# EAGLE design expansion_module_sw8_btn4 (EAGLE 9.6.2)
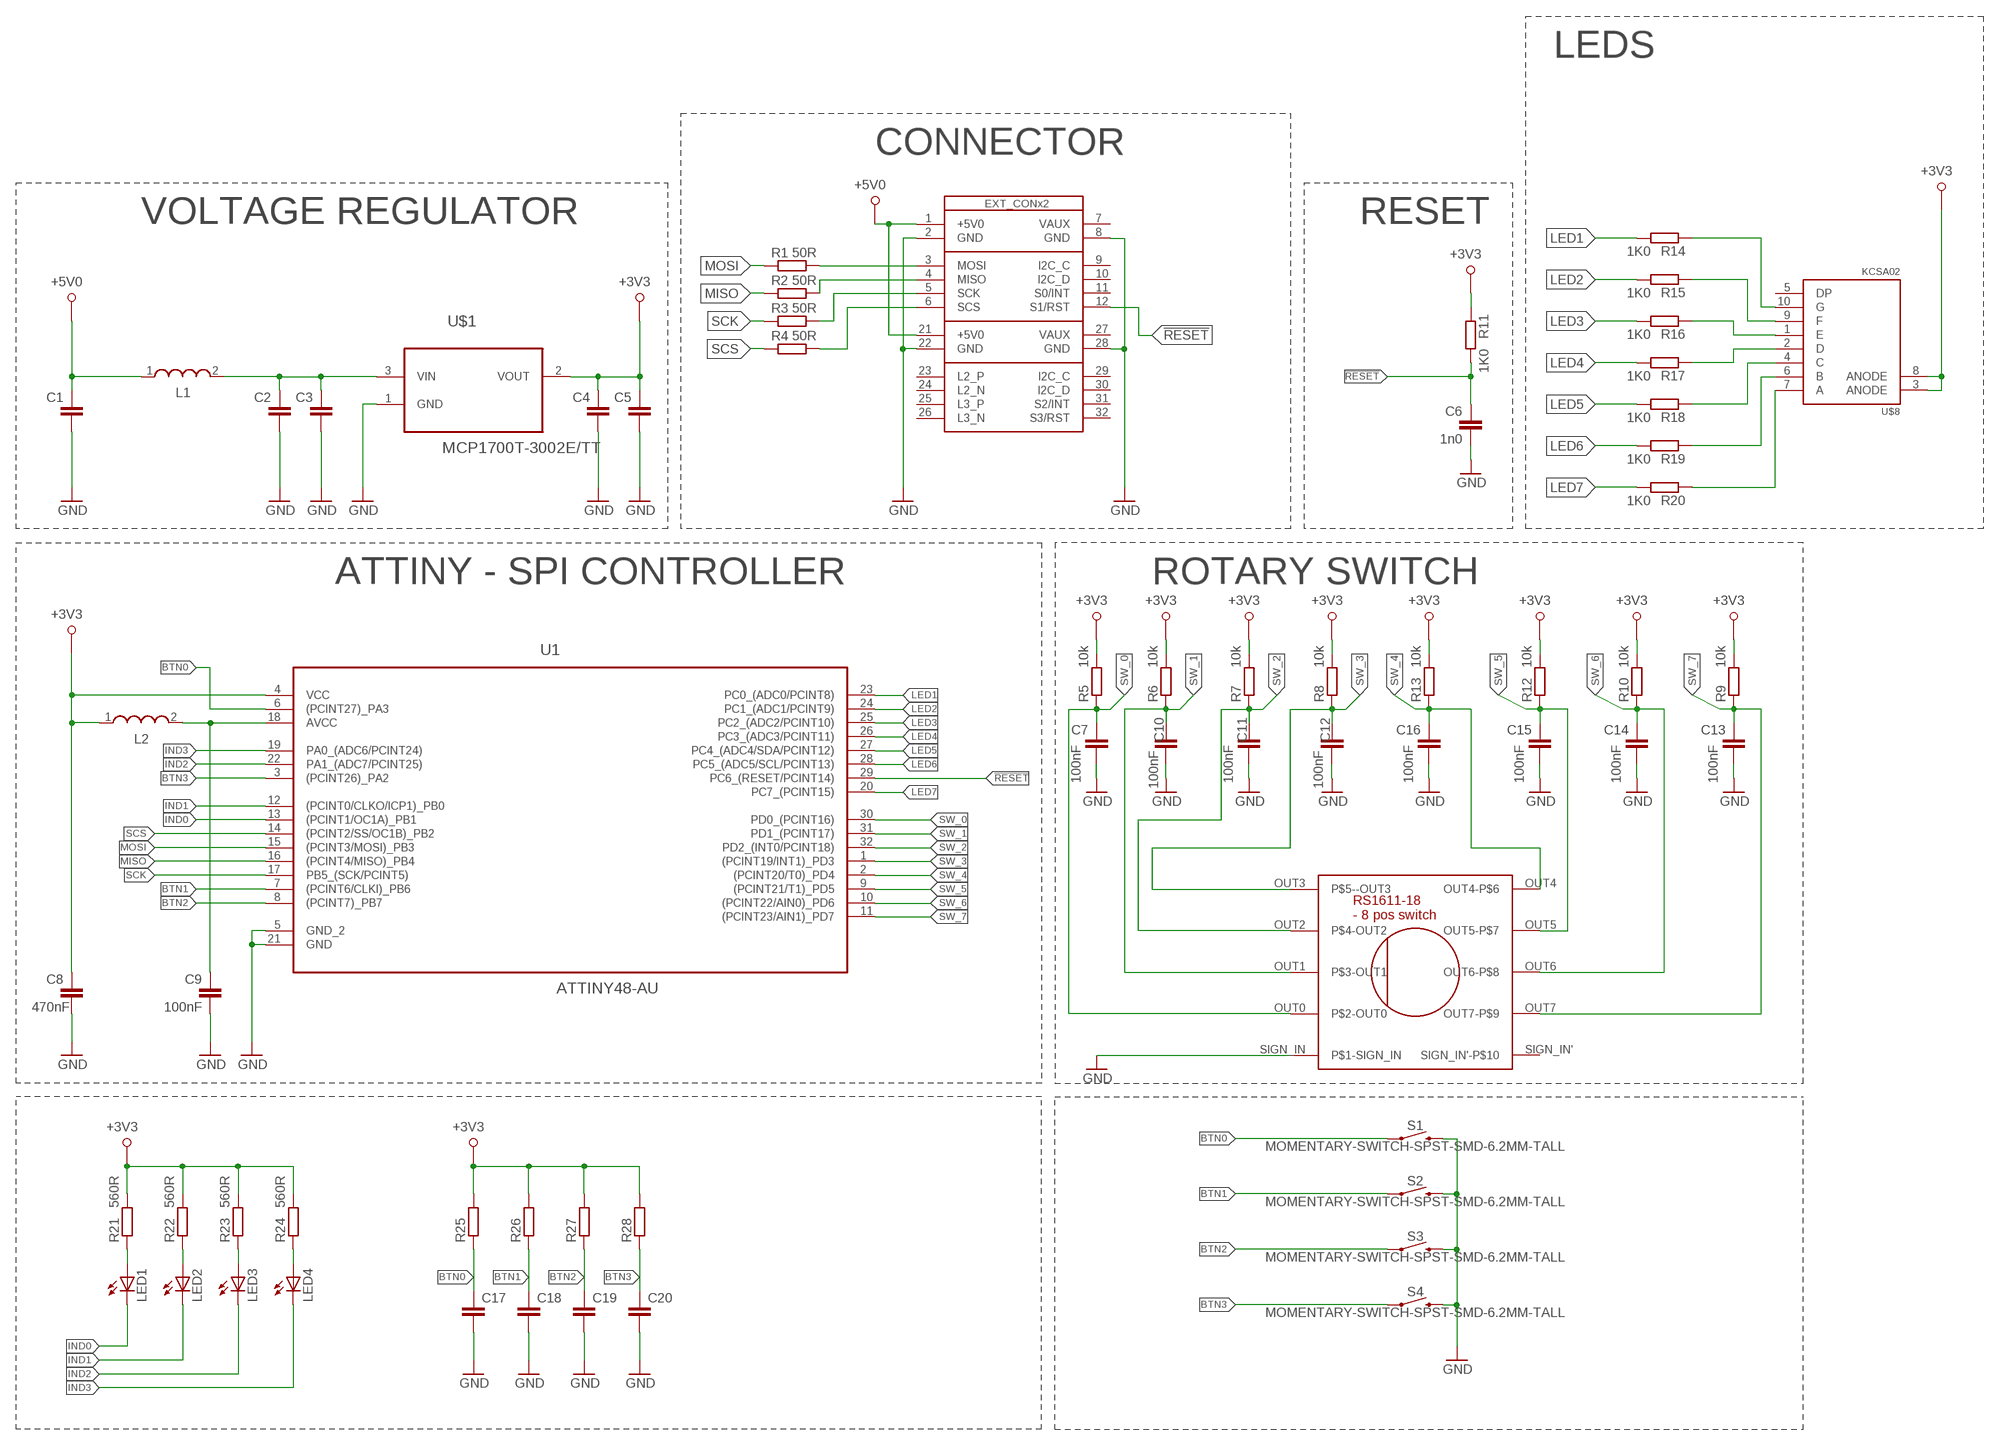
[diagram p0: schematic, sheet 1]

## Parts
C1  C-EUC0805  [C0805]
C2  C-EUC0805  [C0805]
C3  C-EUC0805  [C0805]
C4  C-EUC0805  [C0805]
C5  C-EUC0805  [C0805]
C6  1n0  C-EUC0805  [C0805]
C7  100nF  C-EUC0805  [C0805]
C8  470nF  C-EUC0805  [C0805]
C9  100nF  C-EUC0805  [C0805]
C10  100nF  C-EUC0805  [C0805]
C11  100nF  C-EUC0805  [C0805]
C12  100nF  C-EUC0805  [C0805]
C13  100nF  C-EUC0805  [C0805]
C14  100nF  C-EUC0805  [C0805]
C15  100nF  C-EUC0805  [C0805]
C16  100nF  C-EUC0805  [C0805]
C17  C-EUC0603K  [C0603K]
C18  C-EUC0603K  [C0603K]
C19  C-EUC0603K  [C0603K]
C20  C-EUC0603K  [C0603K]
L1  WE-LQ_1210  [WE-LQ_M]
L2  WE-PMI_0805  [WE-PMI_0805]
LED1  LEDCHIPLED_0805  [CHIPLED_0805]
LED2  LEDCHIPLED_0805  [CHIPLED_0805]
LED3  LEDCHIPLED_0805  [CHIPLED_0805]
LED4  LEDCHIPLED_0805  [CHIPLED_0805]
R1  50R  R-EU_R0805  [R0805]
R2  50R  R-EU_R0805  [R0805]
R3  50R  R-EU_R0805  [R0805]
R4  50R  R-EU_R0805  [R0805]
R5  10k  R-EU_R0805  [R0805]
R6  10k  R-EU_R0805  [R0805]
R7  10k  R-EU_R0805  [R0805]
R8  10k  R-EU_R0805  [R0805]
R9  10k  R-EU_R0805  [R0805]
R10  10k  R-EU_R0805  [R0805]
R11  1K0  R-EU_R0805  [R0805]
R12  10k  R-EU_R0805  [R0805]
R13  10k  R-EU_R0805  [R0805]
R14  1K0  R-EU_R0805  [R0805]
R15  1K0  R-EU_R0805  [R0805]
R16  1K0  R-EU_R0805  [R0805]
R17  1K0  R-EU_R0805  [R0805]
R18  1K0  R-EU_R0805  [R0805]
R19  1K0  R-EU_R0805  [R0805]
R20  1K0  R-EU_R0805  [R0805]
R21  560R  R-EU_R0805  [R0805]
R22  560R  R-EU_R0805  [R0805]
R23  560R  R-EU_R0805  [R0805]
R24  560R  R-EU_R0805  [R0805]
R25  R-EU_R0603  [R0603]
R26  R-EU_R0603  [R0603]
R27  R-EU_R0603  [R0603]
R28  R-EU_R0603  [R0603]
S1  MOMENTARY-SWITCH-SPST-SMD-6.2MM-TALL  [TACTILE_SWITCH_SMD_6.2MM_TALL]
S2  MOMENTARY-SWITCH-SPST-SMD-6.2MM-TALL  [TACTILE_SWITCH_SMD_6.2MM_TALL]
S3  MOMENTARY-SWITCH-SPST-SMD-6.2MM-TALL  [TACTILE_SWITCH_SMD_6.2MM_TALL]
S4  MOMENTARY-SWITCH-SPST-SMD-6.2MM-TALL  [TACTILE_SWITCH_SMD_6.2MM_TALL]
U1  ATTINY48-AU  [QFP80P900X900X120-32N]
U$1  MCP1700T-3002E/TT  [SOT95P237X112-3N]
U$8  KCSA02-109-SMALL  [KCSX02-SM]
U$20  RS1611-18_ROTARY_SW  [RS1611-PACKAGE]
U$37  SB_EXT_CON_X2_SPI  [SB_EXT_CON_X2_FULL]

## Nets
!RESET: C6.2 R11.2 U1.29(PC6_(RESET/PCINT14)) U$37.12(S1/RST)
+3V3: C4.2 C5.2 C8.2 L2.1 R5.2 R6.2 R7.2 R8.2 R9.2 R10.2 R11.1 R12.2 R13.2 R21.2 R22.2 R23.2 R24.2 R25.2 R26.2 R27.2 R28.2 U1.4(VCC) U$1.2(VOUT) U$8.3(ANODE) U$8.8(ANODE)
+5V0: C1.2 L1.1 U$37.1(+5V0) U$37.21(+5V0)
BTN0: C17.1 R25.1 S1.A2 U1.6((PCINT27)_PA3)
BTN1: C18.1 R26.1 S2.A2 U1.7((PCINT6/CLKI)_PB6)
BTN2: C19.1 R27.1 S3.A2 U1.8((PCINT7)_PB7)
BTN3: C20.1 R28.1 S4.A2 U1.3((PCINT26)_PA2)
GND: C1.1 C2.1 C3.1 C4.1 C5.1 C6.1 C7.1 C8.1 C9.1 C10.1 C11.1 C12.1 C13.1 C14.1 C15.1 C16.1 C17.2 C18.2 C19.2 C20.2 S1.B2 S2.B2 S3.B2 S4.B2 U1.5(GND_2) U1.21(GND) U$1.1(GND) U$20.SIGN_IN(P$1-SIGN_IN) U$37.2(GND) U$37.8(GND) U$37.22(GND) U$37.28(GND)
IND0: LED1.C U1.13((PCINT1/OC1A)_PB1)
IND1: LED2.C U1.12((PCINT0/CLKO/ICP1)_PB0)
IND2: LED3.C U1.22(PA1_(ADC7/PCINT25))
IND3: LED4.C U1.19(PA0_(ADC6/PCINT24))
LED1: R14.2 U1.23(PC0_(ADC0/PCINT8))
LED2: R15.2 U1.24(PC1_(ADC1/PCINT9))
LED3: R16.2 U1.25(PC2_(ADC2/PCINT10))
LED4: R17.2 U1.26(PC3_(ADC3/PCINT11))
LED5: R18.2 U1.27(PC4_(ADC4/SDA/PCINT12))
LED6: R19.2 U1.28(PC5_(ADC5/SCL/PCINT13))
LED7: R20.2 U1.20(PC7_(PCINT15))
MISO: R2.1 U1.16((PCINT4/MISO)_PB4)
MOSI: R1.1 U1.15((PCINT3/MOSI)_PB3)
N$1: R1.2 U$37.3(MOSI)
N$2: R2.2 U$37.4(MISO)
N$3: R3.2 U$37.5(SCK)
N$4: R4.2 U$37.6(SCS)
N$6: C9.2 L2.2 U1.18(AVCC)
N$7: LED1.A R21.1
N$8: C2.2 C3.2 L1.2 U$1.3(VIN)
N$9: R14.1 U$8.10(G)
N$11: R15.1 U$8.9(F)
N$12: R16.1 U$8.1(E)
N$13: R17.1 U$8.2(D)
N$14: R18.1 U$8.4(C)
N$15: R19.1 U$8.6(B)
N$16: R20.1 U$8.7(A)
N$17: LED2.A R22.1
N$18: LED3.A R23.1
N$19: LED4.A R24.1
SCK: R3.1 U1.17(PB5_(SCK/PCINT5))
SCS: R4.1 U1.14((PCINT2/SS/OC1B)_PB2)
SW_0: C7.2 R5.1 U1.30(PD0_(PCINT16)) U$20.OUT0(P$2-OUT0)
SW_1: C10.2 R6.1 U1.31(PD1_(PCINT17)) U$20.OUT1(P$3-OUT1)
SW_2: C11.2 R7.1 U1.32(PD2_(INT0/PCINT18)) U$20.OUT2(P$4-OUT2)
SW_3: C12.2 R8.1 U1.1((PCINT19/INT1)_PD3) U$20.OUT3(P$5--OUT3)
SW_4: C16.2 R13.1 U1.2((PCINT20/T0)_PD4) U$20.OUT4(OUT4-P$6)
SW_5: C15.2 R12.1 U1.9((PCINT21/T1)_PD5) U$20.OUT5(OUT5-P$7)
SW_6: C14.2 R10.1 U1.10((PCINT22/AIN0)_PD6) U$20.OUT6(OUT6-P$8)
SW_7: C13.2 R9.1 U1.11((PCINT23/AIN1)_PD7) U$20.OUT7(OUT7-P$9)
Unconnected: U$8.5(DP) U$20.SIGN_IN'(SIGN_IN'-P$10) U$37.7(VAUX) U$37.9(I2C_C) U$37.10(I2C_D) U$37.11(S0/INT) U$37.23(L2_P) U$37.24(L2_N) U$37.25(L3_P) U$37.26(L3_N) U$37.27(VAUX) U$37.29(I2C_C) U$37.30(I2C_D) U$37.31(S2/INT) U$37.32(S3/RST)

## Notes on the sheet
- LEDS
- CONNECTOR
- VOLTAGE REGULATOR | RESET
- ATTINY - SPI CONTROLLER | ROTARY SWITCH

## Library data of the parts
C1-C20 = resistor:C-EU: CAPACITOR, European symbol
L1 = EagleLibrary_Wuerth_Elektronik_eiSos_rev16a:WE-LQ: SMD Inductor Characteristics Miniature chip inductor wound on a special ferrite core Small inductances for compact circuits High Q at high frequencies Low DC-resistance Operating temperature: –40 ºC to +125 ºC Applications Low power DC/DC-converters from Linear Technology, National Semiconductor, Texas Instruments, Fairchild Semiconductor, ON Semiconductor, STMicroelectronics, Maxim, MPS, Semtech, Exar, Analogic Tech, Diodes and Cologne Chip EMI-Filtering RF-circuits <http://katalog.we-online.de/media/images/eisos/IndLQ_pf2.jpg> Details see: http://katalog.we-online.de/en/pbs/WE-LQ? Updated by Dan Xu 2014-07-08 2014 (C) Wurth Elektronik
L2 = EagleLibrary_Wuerth_Elektronik_eiSos_rev16a:WE-PMI: Power Multilayer Inductor Characteristics Compact multilayer type Suitable for applications with high currents up to 2.7 A Smallest RDC-Values starting at 40 mΩ Magnetically shielded construction: No crosstalk Operating temperature: –40 °C to +125 °C Available in four sizes and three different types (Low Profile, Low RDC & High Saturation Current) Recommended soldering profile: Reflow Applications DC/DC converters especially at high switching frequencies > 1 MHz Electronic devices with very low profile Portable devices like Smart Phones, Tablets, Notebooks and Digital Cameras <http://katalog.we-online.de/media/images/eisos/IndPMI_pf2.jpgg> Details see: http://katalog.we-online.de/en/pbs/WE-PMI? Updated by Dan Xu 2014-07-08 2014 (C) Wurth Elektronik
LED1-LED4 = led:LED: LED OSRAM: - CHIPLED LG R971, LG N971, LY N971, LG Q971, LY Q971, LO R971, LY R971 LH N974, LH R974 LS Q976, LO Q976, LY Q976 LO Q996 - Hyper CHIPLED LW Q18S LB Q993, LB Q99A, LB R99A - SideLED LS A670, LO A670, LY A670, LG A670, LP A670 LB A673, LV A673, LT A673, LW A673 LH A674 LY A675 LS A676, LA A676, LO A676, LY A676, LW A676 LS A679, LY A679, LG A679 - Hyper Micro SIDELED® LS Y876, LA Y876, LO Y876, LY Y876 LT Y87S - SmartLED LW L88C, LW L88S LB L89C, LB L89S, LG L890 LS L89K, LO L89K, LY L89K LS L896, LA L896, LO L896, LY L896 - TOPLED LS T670, LO T670, LY T670, LG T670, LP T670 LSG T670, LSP T670, LSY T670, LOP T670, LYG T670 LG T671, LOG T671, LSG T671 LB T673, LV T673, LT T673, LW T673 LH T674 LS T676, LA T676, LO T676, LY T676, LB T676, LH T676, LSB T676, LW T676 LB T67C, LV T67C, LT T67C, LS T67K, LO T67K, LY T67K, LW E67C LS E67B, LA E67B, LO E67B, LY E67B, LB E67C, LV E67C, LT E67C LW T67C LS T679, LY T679, LG T679 LS T770, LO T770, LY T770, LG T770, LP T770 LB T773, LV T773, LT T773, LW T773 LH T774 LS E675, LA E675, LY E675, LS T675 LS T776, LA T776, LO T776, LY T776, LB T776 LHGB T686 LT T68C, LB T68C - Hyper Mini TOPLED® LB M676 - Mini TOPLED Santana® LG M470 LS M47K, LO M47K, LY M47K Source: http://www.osram.convergy.de LUXEON: - LUMILED® LXK2-PW12-R00, LXK2-PW12-S00, LXK2-PW14-U00, LXK2-PW14-V00 LXK2-PM12-R00, LXK2-PM12-S00, LXK2-PM14-U00 LXK2-PE12-Q00, LXK2-PE12-R00, LXK2-PE12-S00, LXK2-PE14-T00, LXK2-PE14-U00 LXK2-PB12-K00, LXK2-PB12-L00, LXK2-PB12-M00, LXK2-PB14-N00, LXK2-PB14-P00, LXK2-PB14-Q00 LXK2-PR12-L00, LXK2-PR12-M00, LXK2-PR14-Q00, LXK2-PR14-R00 LXK2-PD12-Q00, LXK2-PD12-R00, LXK2-PD12-S00 LXK2-PH12-R00, LXK2-PH12-S00 LXK2-PL12-P00, LXK2-PL12-Q00, LXK2-PL12-R00 Source: www.luxeon.com KINGBRIGHT: KA-3528ASYC Source: www.kingbright.com
R1-R28 = resistor:R-EU_: RESISTOR, European symbol
S1-S4 = SparkFun-Switches:MOMENTARY-SWITCH-SPST: Momentary Switch (Pushbutton) - SPST Normally-open (NO) SPST momentary switches (buttons, pushbuttons). Variants PTH-12MM - 12mm square, through-hole Momentary Pushbutton Switch - 12mm Square <https://www.sparkfun.com/products/9190> (COM-09190) PTH-6.0MM, PTH-6.0MM-KIT - 6.0mm square, through-hole Mini Pushbutton Switch <https://www.sparkfun.com/products/97> (COM-00097) KIT package intended for soldering kit's - only one side of pads' copper is exposed. PTH-RIGHT-ANGLE-KIT - Right-angle, through-hole Right Angle Tactile Button <https://www.sparkfun.com/products/10791> - Used on SparkFun BigTime Watch Kit <https://www.sparkfun.com/products/11734> SMD-12MM - 12mm square, surface-mount Tactile Button - SMD (12mm) <https://www.sparkfun.com/products/12993> (COM-12993) Used on SparkFun PicoBoard <https://www.sparkfun.com/products/11888> SMD-4.5MM - 4.5mm Square Trackball Switch Used on SparkFun Blackberry Trackballer Breakout <https://www.sparkfun.com/products/13169> SMD-4.6MMX2.8MM - 4.60mm x 2.80mm, surface mount Used on SparkFun SAMD21 Mini Breakout <https://www.sparkfun.com/products/13664> SMD-5.2MM, SMD-5.2-REDUNDANT - 5.2mm square, surface-mount Mini Pushbutton Switch - SMD <https://www.sparkfun.com/products/8720> (COM-08720) Used on Arduino Pro Mini <https://www.sparkfun.com/products/11114> REDUNDANT package connects both switch circuits together SMD-6.0X3.5MM - 6.0 x 3.5mm, surface mount Momentary Reset Switch SMD <https://www.sparkfun.com/products/8229> (COM-08229) SMD-6.2MM-TALL - 6.2mm square, surface mount Tactile Button - SMD (6mm) <https://www.sparkfun.com/products/12992> Used on SparkFun Digital Sandbox <https://www.sparkfun.com/products/12651> SMD-RIGHT-ANGLE - Right-angle, surface mount Used on SparkFun Block for Intel® Edison - Arduino <https://www.sparkfun.com/products/13036>; PROD_ID: SWCH-11966; SF_SKU: COM-12992
U1 = Atmel_By_element14_Batch_1-00:ATTINY48-AU: 8-bit Microcontroller; MPN: ATTINY48-AU; OC_FARNELL: 1636953; OC_NEWARK: 68T3768; PACKAGE: QFP-32; SUPPLIER: Atmel
U$1 = Microchip_By_element14_Batch_1:MCP1700T-3002E/TT: Low Quiescent Current LDO; MPN: MCP1700T-3002E/TT; OC_FARNELL: 1331482; OC_NEWARK: 84R5176; PACKAGE: SOT23-3; SUPPLIER: Microchip
U$8 = kcsx02:KCSA02-109: KCSA02-109 LED 7 Segment
U$20 = rs1611-18:RS1611-18_ROTARY_SW
U$37 = al_smartboard:SB_EXT_CON_X2_SPI

## Net classes
0 default: clearance 0.205 mm

## Board
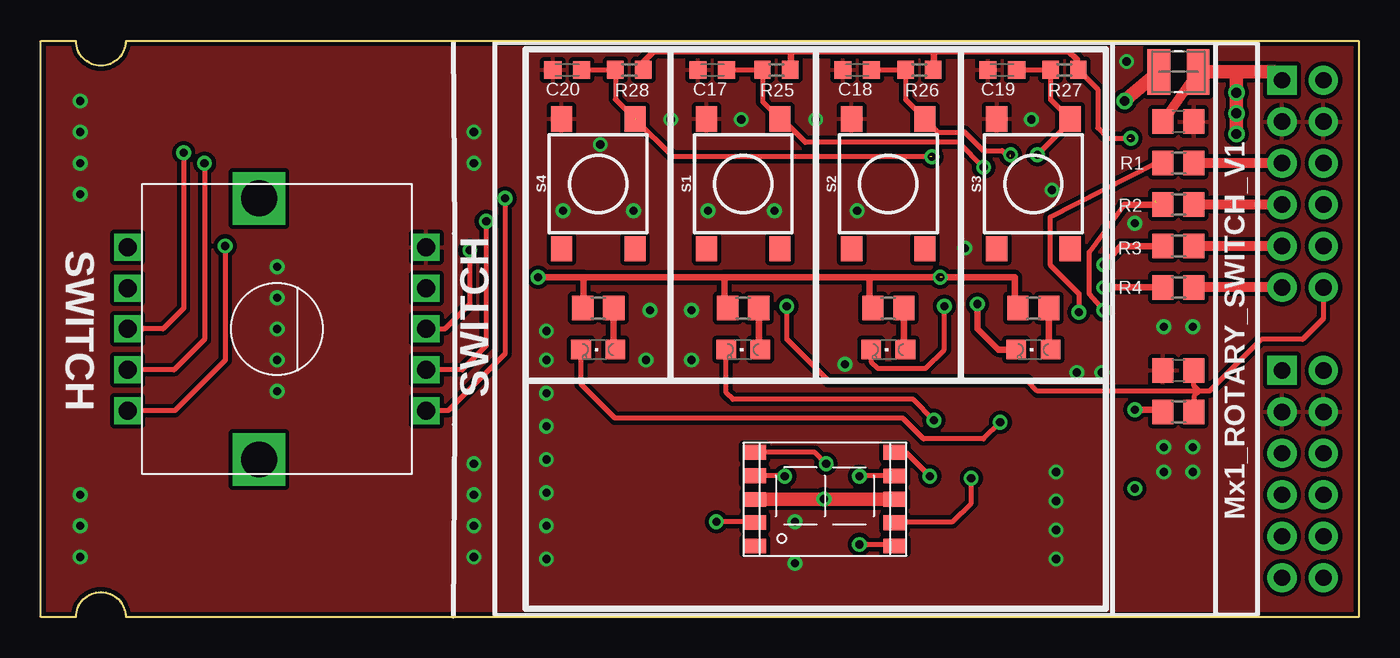
[diagram p1: board, top side]
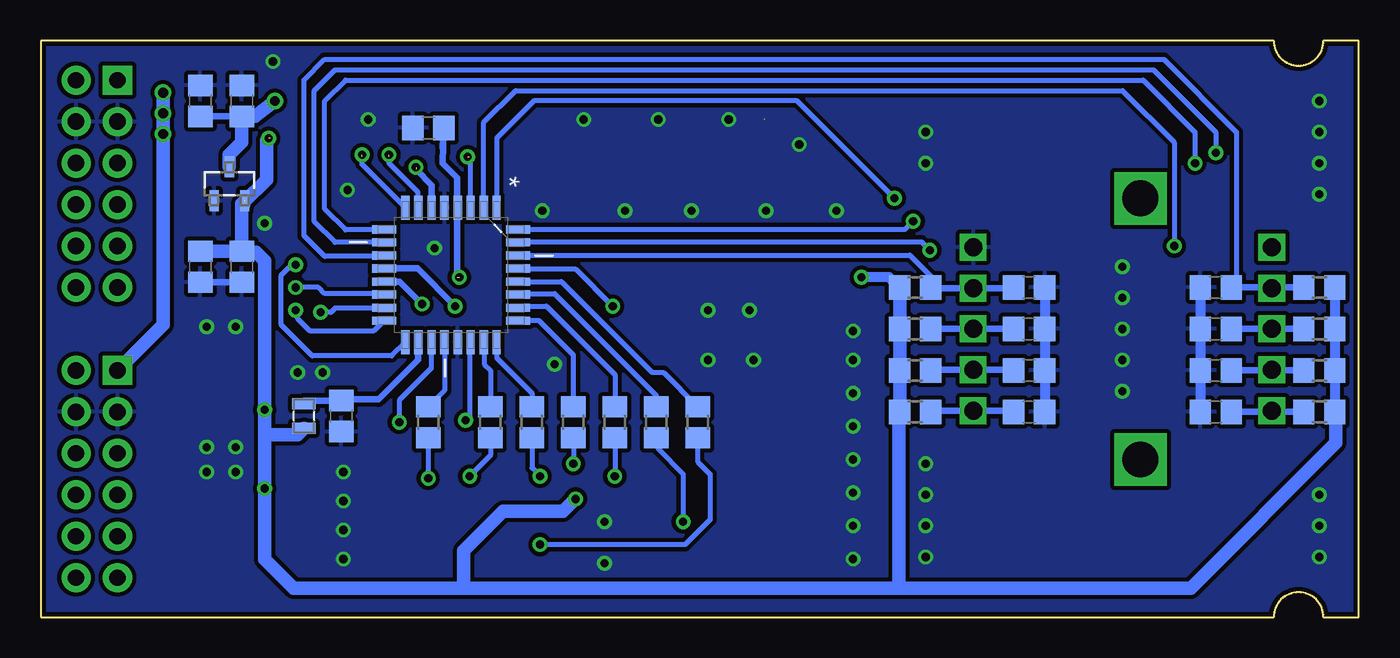
[diagram p2: board, bottom side, seen from below]

Size 80.77 x 35.31 mm. Coordinates in mm from the lower left corner, seen from the top.
Copper layers (1*16): Top 0.035mm / dielectric 1.5mm / Bottom 0.035mm
Design rules "default *": minimum track width 10mil, minimum drill 24mil, track to track 10mil, track to pad 8mil, pad to pad 8mil, via to via 8mil, smd to smd 8mil, copper to edge 10mil, drill to drill 10mil, minimum pad ring 10mil, minimum via ring 8mil, stop-mask expansion 4mil, vias tented up to drill 20mil, thermal gap 10mil

### Footprints (pad centres in the part's own frame; a part is rotated, then mirrored left to right if it is on the bottom)
C0805 = smd 1.3 x 1.5: 1 -0.95,0; 2 0.95,0
C0603K = smd 1.05 x 1.08: 1 -0.875,0; 2 0.875,0
WE-LQ_M = smd 1.4 x 2.8: 1 -1.2,0; 2 1.2,0
WE-PMI_0805 = smd 0.7 x 1.45: 1 -0.75,0; 2 0.75,0
CHIPLED_0805 = smd 1.2 x 1.2: A 0,-1.05; C 0,1.05
R0805 = smd 1.3 x 1.5: 1 -0.95,0; 2 0.95,0
R0603 = smd 1 x 1.1: 1 -0.85,0; 2 0.85,0
TACTILE_SWITCH_SMD_6.2MM_TALL = smd 1.55 x 1.3: A1 -3.975,-2.25; A2 3.975,-2.25; B1 -3.975,2.25; B2 3.975,2.25
QFP80P900X900X120-32N = smd 1.473 x 0.508: 1 -4.115,2.794; 2 -4.115,2.007; 3 -4.115,1.194; 4 -4.115,0.406; 5 -4.115,-0.406; 6 -4.115,-1.194; 7 -4.115,-2.007; 8 -4.115,-2.794; 17 4.115,-2.794; 18 4.115,-2.007; 19 4.115,-1.194; 20 4.115,-0.406; 21 4.115,0.406; 22 4.115,1.194; 23 4.115,2.007; 24 4.115,2.794 | smd 0.508 x 1.473: 9 -2.794,-4.115; 10 -2.007,-4.115; 11 -1.194,-4.115; 12 -0.406,-4.115; 13 0.406,-4.115; 14 1.194,-4.115; 15 2.007,-4.115; 16 2.794,-4.115; 25 2.794,4.115; 26 2.007,4.115; 27 1.194,4.115; 28 0.406,4.115; 29 -0.406,4.115; 30 -1.194,4.115; 31 -2.007,4.115; 32 -2.794,4.115
SOT95P237X112-3N = smd 0.559 x 1.27: 1 -0.94,-1.041; 2 0.94,-1.041; 3 0,1.041
KCSX02-SM = smd 0.9 x 1.4: 1 0.57,0.68; 2 2.01,0.68; 3 3.46,0.7; 4 4.87,0.7; 5 6.31,0.7; 6 6.32,9.3; 7 4.89,9.28; 8 3.45,9.28; 9 2.02,9.28; 10 0.57,9.3
RS1611-PACKAGE = drill 1.1 square: OUT0 2.5,-9.15; OUT1 0,-9.15; OUT2 -2.5,-9.15; OUT3 -5,-9.15; OUT4 -5,9.15; OUT5 -2.5,9.15; OUT6 0,9.15; OUT7 2.5,9.15; SIGN_IN 5,-9.15; SIGN_IN' 5,9.15 | drill 2.2 square: P$1 -8,1.1; P$2 8,1.1
SB_EXT_CON_X2_FULL = drill 1 pad 1.778 square: 1 33.02,5.08; 21 15.24,5.08 | drill 1 pad 1.778: 2 30.48,5.08; 3 27.94,5.08; 4 25.4,5.08; 5 22.86,5.08; 6 20.32,5.08; 7 33.02,2.54; 8 30.48,2.54; 9 27.94,2.54; 10 25.4,2.54; 11 22.86,2.54; 12 20.32,2.54; 22 12.7,5.08; 23 10.16,5.08; 24 7.62,5.08; 25 5.08,5.08; 26 2.54,5.08; 27 15.24,2.54; 28 12.7,2.54; 29 10.16,2.54; 30 7.62,2.54; 31 5.08,2.54; 32 2.54,2.54

### Placement (x,y rotation side)
C1  69.72,30.35 180 top
C2  70.99,31.62 270 bottom
C3  68.45,31.62 270 bottom
C4  68.45,21.46 90 bottom
C5  70.99,21.46 90 bottom
C6  69.72,15.11 0 top
C7  20.19,20.19 180 bottom
C8  57.02,29.97 0 bottom
C9  62.36,12.32 90 bottom
C10  20.19,17.65 180 bottom
C11  20.19,15.11 180 bottom
C12  20.19,12.57 180 bottom
C13  8.76,20.19 0 bottom
C14  8.76,17.65 0 bottom
C15  8.76,15.11 0 bottom
C16  8.76,12.57 0 bottom
C17  41.15,33.53 180 top
C18  50.04,33.53 180 top
C19  58.93,33.53 180 top
C20  32.26,33.53 180 top
L1  69.72,33.4 180 top
L2  64.64,12.32 90 bottom
LED1  60.83,16.38 90 top
LED2  51.94,16.38 90 top
LED3  43.05,16.38 90 top
LED4  34.16,16.38 90 top
R1  69.72,27.81 0 top
R2  69.72,25.27 0 top
R3  69.72,22.73 0 top
R4  69.72,20.19 0 top
R5  27.18,20.19 180 bottom
R6  27.18,17.65 180 bottom
R7  27.18,15.11 180 bottom
R8  27.18,12.57 180 bottom
R9  2.41,20.19 0 bottom
R10  2.41,17.65 0 bottom
R11  69.72,12.57 0 top
R12  2.41,15.11 0 bottom
R13  2.41,12.57 0 bottom
R14  53.21,11.94 90 bottom
R15  50.67,11.94 90 bottom
R16  48.13,11.94 90 bottom
R17  45.59,11.94 90 bottom
R18  43.05,11.94 90 bottom
R19  40.51,11.94 90 bottom
R20  57.02,11.94 90 bottom
R21  60.83,18.92 180 top
R22  51.94,18.92 180 top
R23  43.05,18.92 180 top
R24  34.16,18.92 180 top
R25  45.09,33.53 0 top
R26  53.85,33.53 0 top
R27  62.74,33.53 0 top
R28  36.07,33.53 0 top
S1  43.05,26.54 90 top
S2  51.94,26.54 90 top
S3  60.83,26.54 90 top
S4  34.16,26.54 90 top
U1  55.63,20.95 270 bottom
U$1  69.22,26.54 0 bottom
U$8  43.05,10.67 270 top
U$20  14.48,17.65 90 top
U$37  81.15,-0.13 90 top

### Tracks (layer width: path | path; a pad name or v marks a point on that pad's centre or on a via)
!RESET  (via drill 0.5)
  Top 0.305: U$37.12 78.61,18.29 77.34,17.02 74.8,17.02 71.63,13.84 70.99,13.84 | 70.99,13.84 70.67,14.16 C6.2 | 70.99,13.84 70.67,13.52 R11.2 | v45.72,19.05 45.72,17.02 48.26,14.48 60.45,14.48 61.09,13.84 70.99,13.84
  Bottom 0.305: 51.49,21.34 48.01,21.34 v45.72,19.05
  Bottom 0.406: U1.29 51.49,21.34
+3V3  (via drill 0.5)  (3 unrouted)
  Top 0.305: R27.2 64.77,32.35 64.77,29.97 65.41,29.34 66.68,29.34
  Top 0.406: R11.1 68.65,12.7 v67.06,12.7 | U$8.3 | R27.2 63.5,33.62 63.5,34.16 62.99,34.67 54.74,34.67 | R28.2 36.92,34 37.59,34.67 45.97,34.67 | 54.74,34.67 45.97,34.67 | R25.2 45.97,33.57 45.97,34.67 | R26.2 54.74,33.57 54.74,34.67 | 33.27,20.83 v30.48,20.83 | 33.27,20.83 41.91,20.83 | R24.2 33.27,18.98 33.27,20.83 | R23.2 41.91,19.12 41.91,20.83 | 50.8,20.83 v55.12,20.83 59.69,20.83 59.69,19.12 R21.2 | 50.8,20.83 41.91,20.83 | R22.2 50.8,19.12 50.8,20.83 | 52.32,7.21 52.29,7.24 v48.01,7.24
  Top 0.813: U$8.8 52.32,7.21 U$8.3
  Bottom 0.406: 55.25,20.83 55.25,25.04 U1.4 55.25,25.09 55.25,26.92 56.13,27.81 C8.2 56.13,28.77 | 65.28,1.78 65.15,1.9 54.86,1.9
  Bottom 0.61: R9.2 R10.2 R12.2 R13.2 | R5.2 28.76,20.83 v30.48,20.83
  Bottom 0.813: R13.2 1.4,12.51 1.4,10.67 10.29,1.78 28.17,1.78 | 28.17,1.78 28.17,12.53 R8.2 R7.2 R6.2 R5.2 | C4.2 C5.2 | C4.2 68.39,22.35 67.56,22.35 67.06,21.84 v67.06,12.7 67.06,11.18 | L2.1 65.04,11.18 67.06,11.18 | U$1.2 68.45,25.32 C4.2 | v66.8,29.34 66.93,29.21 66.93,26.8 68.33,25.4 68.33,25.27 | 28.17,1.78 65.28,1.78 67.06,3.56 67.06,11.18 | v48.01,7.24 48.77,6.48 52.45,6.48 54.86,4.06 54.86,1.9
+5V0  (via drill 0.6)
  Top 0.61: L1.1 C1.2
  Top 0.813: 73.28,33.4 75.57,33.4 U$37.1 | 73.28,33.4 L1.1 | 73.28,33.4 v73.28,32.13 v73.28,30.86 v73.28,29.59
  Bottom 0.813: U$37.21 73.28,17.91 v73.28,29.59 v73.28,30.86 v73.28,32.13
BTN0  (via drill 0.5)  (1 unrouted)
  Top 0.305: C17.1 R25.1 44.24,31.59 S1.A2 45.43,30.52 46.86,29.08 56.26,29.08 v57.79,27.56
  Bottom 0.406: U1.6 56.82,26.47 57.79,27.43
BTN1  (via drill 0.5)  (1 unrouted)
  Top 0.305: C18.1 R26.1 53,31.71 S2.A2 54.99,29.72 56.64,29.72 57.79,28.57 58.93,28.57 59.18,28.32 v59.44,28.32
  Bottom 0.305: U1.7 57.66,25.09 57.66,26.04 59.44,27.81 59.44,28.19
BTN2  (via drill 0.5)  (1 unrouted)
  Top 0.305: C19.1 R27.1 61.89,31.71 S3.A2 63.08,30.32 v61.09,28.32
  Bottom 0.305: U1.8 61.09,27.74 61.09,28.19
BTN3  (via drill 0.5)  (2 unrouted)
  Top 0.305: C20.1 R28.1 35.22,31.71 S4.A2 | v54.61,28.19 38.74,28.19 36.45,30.48
  Bottom 0.305: U1.3 54.43,28.14 54.48,28.19
GND  (via drill 0.5)
  Bottom 0.406: C4.1 C5.1
  Bottom 0.61: C13.1 C16.1 | C7.1 C12.1
  other vias: 2.41,31.62 2.41,29.72 2.41,27.81 2.41,25.91 2.41,7.49 2.41,5.59 2.41,3.68 14.48,17.65 14.48,19.56 14.48,21.46 14.48,15.75 14.48,13.84 26.54,3.68 26.54,5.59 26.54,7.49 26.54,9.4 26.54,27.81 26.54,29.72 68.83,17.78 70.61,17.78 63.5,14.99 65.02,14.99 68.83,10.41 70.61,10.41 68.83,8.89 70.61,8.89 62.23,8.89 62.23,7.11 62.23,5.33 62.23,3.56 46.23,3.3 46.23,5.84 30.99,3.56 30.99,5.59 30.99,7.62 30.99,9.65 30.99,11.68 30.99,13.72 30.99,15.75 30.99,17.53 40.89,24.89 44.96,24.89 50.04,24.89 36.32,24.89 32,24.89 42.93,30.48 47.5,30.48 38.61,30.48 34.29,28.96 60.71,30.48 61.98,26.16 66.55,34.04 67.06,24.13 49.28,15.49 39.88,18.8 37.34,18.8 37.08,15.75 39.88,15.75 56.64,22.61
  pour Bottom (isolate 0.254): -0.13,35.56 81.53,35.43 81.53,-0.38 -0.13,-0.25
  pour Top (isolate 0.229): 0.13,38.61 81.28,38.73 81.53,-2.16 0.38,-2.29
IND0  (via drill 0.5)
  Top 0.406: v57.4,19.18 57.4,17.65 58.67,16.38 LED1.C
  Bottom 0.406: U1.13 58.78,20.55 v57.4,19.18
IND1  (via drill 0.5)
  Top 0.305: LED2.C 50.89,15.66 51.31,15.24 54.23,15.24 55.37,16.38 v55.37,19.05
  Bottom 0.406: U1.12 57.68,21.36 v55.37,19.05
IND2  (via drill 0.5)
  Top 0.305: v54.74,12.06 53.47,13.33 42.42,13.33 42,13.75 LED3.C
  Bottom 0.305: U1.22 54.48,16.79 54.48,12.32 v54.74,12.06
IND3  (via drill 0.5)
  Top 0.305: v58.8,11.94 57.79,10.92 54.1,10.92 52.83,12.19 35.18,12.19 33.11,14.26 LED4.C
  Bottom 0.305: U1.19 56.85,16.82 56.85,15.24 58.8,13.28 v58.8,11.94
LED1
  Bottom 0.305: U1.23 53.59,16.82 53.59,15.49 53.21,15.11 R14.2
LED2
  Bottom 0.305: U1.24 52.83,15.88 50.67,13.72 R15.2
LED3
  Bottom 0.305: R16.2 48.13,16.05 50.24,18.16 U1.25
LED4
  Bottom 0.305: U1.26 51.41,19.05 49.78,19.05 45.59,14.86 R17.2
LED5
  Bottom 0.305: U1.27 51.46,19.81 49.28,19.81 43.05,13.59 R18.2
LED6
  Bottom 0.305: 51.49,20.57 U1.28 48.87,20.55 43.31,14.99 42.61,14.99 R19.2
LED7
  Bottom 0.305: 56.01,16.82 U1.20 56.03,13.88 R20.2
MISO  (via drill 0.5)
  Top 0.305: 66.42,25.27 64.26,22.35 64.26,19.81 v65.15,18.8
  Top 0.406: R2.1 66.42,25.27
  Bottom 0.305: U1.16 60.38,17.53 64.26,17.53 65.02,18.29 v65.15,18.8
  Bottom 0.406: 59.56,18.16 U1.16
MOSI  (via drill 0.5)
  Top 0.305: R1.1 68.33,27.81 61.85,24.51 61.85,21.59 63.63,19.81 v63.63,18.67
  Bottom 0.305: v63.63,18.67 62.99,18.67 62.74,18.92 59.77,18.92
  Bottom 0.406: U1.15 59.77,18.92
N$1
  Top 0.61: U$37.3 R1.2
N$2
  Top 0.61: U$37.4 R2.2
N$3
  Top 0.61: U$37.5 R3.2
N$4
  Top 0.61: U$37.6 R4.2
N$6
  Bottom 0.406: 57.66,16.82 U1.18 57.63,15.77 60.07,13.33 62.29,13.33 C9.2 64.64,13.27 L2.2
N$7
  Top 0.406: LED1.A 61.78,16.38 R21.1
N$8  (via drill 0.6)
  Top 0.813: v66.42,31.62 L1.2
  Bottom 0.406: C2.2 C3.2
  Bottom 0.813: v66.42,31.62 67.63,30.67 C3.2 68.45,29.08 69.22,28.32 U$1.3
N$9  (via drill 0.5)
  Top 0.305: U$8.10 53.02,10.1 v54.48,8.64
  Bottom 0.305: R14.1 53.21,9.91 v54.48,8.64
N$11  (via drill 0.5)
  Top 0.305: U$8.9 v50.18,8.65 v50.17,8.64
  Top 0.406: 52.32,8.64 U$8.9
  Bottom 0.305: R15.1 50.67,9.14 v50.17,8.64
N$12  (via drill 0.5)
  Top 0.305: v48.13,9.4 47.43,10.1 U$8.1
  Bottom 0.305: R16.1 v48.13,9.4
N$13  (via drill 0.5)
  Top 0.305: v45.59,8.64 45.57,8.66 U$8.2
  Bottom 0.305: R17.1 v45.59,8.64
N$14  (via drill 0.5)
  Top 0.305: U$8.4 43.71,5.84 v41.4,5.84
  Bottom 0.305: R18.1 42.93,10.86 42.93,10.29 41.4,8.76 v41.4,5.84
N$15  (via drill 0.5)
  Top 0.305: U$8.6 52.26,4.45 v50.17,4.45
  Bottom 0.305: R19.1 40.51,9.53 39.75,8.76 39.75,5.97 41.28,4.45 v50.17,4.45
N$16  (via drill 0.5)
  Top 0.305: U$8.7 52.4,5.84 55.88,5.84 57.02,6.98 v57.02,8.51
  Bottom 0.305: R20.1 v57.02,8.51
N$17
  Top 0.406: LED2.A 52.89,16.38 R22.1
N$18
  Top 0.406: LED3.A 44,16.38 R23.1
N$19
  Top 0.406: LED4.A 35.11,16.38 R24.1
N$22  (via drill 0.5)
  other vias: 67.06,7.87
SCK  (via drill 0.5)
  Top 0.406: R3.1 66.17,22.73 v65.15,21.59
  Bottom 0.305: U1.17 59.26,16 64.14,16 66.04,17.91 66.04,20.95 65.41,21.59 v65.15,21.59
SCS  (via drill 0.5)
  Top 0.305: 65.66,20.19 v65.15,20.19
  Top 0.406: R4.1 65.66,20.19
  Bottom 0.305: U1.14 59.79,19.81 63.37,19.81 63.75,20.19 v65.15,20.19
SW_0
  Bottom 0.305: U1.30 51.49,22.17 27.51,22.17 26.23,20.89 R5.1
  Bottom 0.406: C7.2 21.18,20.15 U$20.OUT0 26.19,20.15 R5.1 | 51.46,22.1 U1.30
SW_1  (via drill 0.5)
  Top 0.305: U$20.OUT1 24.77,17.65 26.29,19.18 v26.29,22.48
  Bottom 0.305: U1.31 51.49,22.99 26.8,22.99 v26.29,22.48
  Bottom 0.406: C10.2 U$20.OUT1 R6.1
SW_2  (via drill 0.5)
  Top 0.305: U$20.OUT2 25.82,15.15 27.31,16.64 v27.31,24.26
  Top 0.406: U$20.OUT2 23.67,15.11
  Bottom 0.305: v27.31,24.26 27.81,23.75 U1.32
  Bottom 0.406: C11.2 21.18,15.15 U$20.OUT2 26.19,15.15 R7.1
SW_3  (via drill 0.5)
  Top 0.305: v28.45,25.65 28.45,16.13 24.97,12.65 U$20.OUT3
  Top 0.406: U$20.OUT3 23.71,12.57
  Bottom 0.305: v28.45,25.65 34.42,31.62 50.55,31.62 52.83,29.34 U1.1
  Bottom 0.406: C12.2 21.22,12.65 U$20.OUT3 26.15,12.65 R8.1
SW_4  (via drill 0.5)
  Top 0.305: v11.3,22.73 11.3,15.75 8.21,12.65 U$20.OUT4
  Bottom 0.305: U1.2 53.62,30.3 51.66,32.26 14.48,32.26 11.3,29.08 v11.3,22.73
  Bottom 0.406: 53.57,25.12 U1.2 | R13.1 5.33,12.57 | C16.2 5.33,12.57 | 5.33,12.57 U$20.OUT4
SW_5  (via drill 0.5)
  Top 0.305: U$20.OUT5 8.17,15.15 10.03,17.02 v10.03,27.81
  Bottom 0.305: U1.9 59.77,23.72 62.1,23.72 63.37,24.99 63.37,31.62 62.1,32.89 13.21,32.89 10.03,29.72 v10.03,27.81
  Bottom 0.406: R12.1 5.33,15.11 | C15.2 5.33,15.11 | 5.33,15.11 U$20.OUT5
SW_6  (via drill 0.5)
  Top 0.305: U$20.OUT6 7.49,17.65 8.76,18.92 v8.76,28.45
  Top 0.406: U$20.OUT6 6.22,17.65
  Bottom 0.305: U1.10 62.74,22.96 64.01,24.23 64.01,32.26 62.74,33.53 12.57,33.53 8.76,29.72 v8.76,28.45
  Bottom 0.406: C14.2 U$20.OUT6 R10.1
SW_7
  Bottom 0.305: U1.11 59.79,22.1 63.37,22.1 64.64,23.37 64.64,32.89 63.37,34.16 11.94,34.16 7.49,29.72 7.49,20.19
  Bottom 0.406: R9.1 5.33,20.19 | C13.2 7.49,20.19 5.33,20.19 | 5.33,20.19 U$20.OUT7

### Text on the board
tPlace: Mx1_ROTARY_SWITCH_V1
tNames: SWITCH | SWITCH